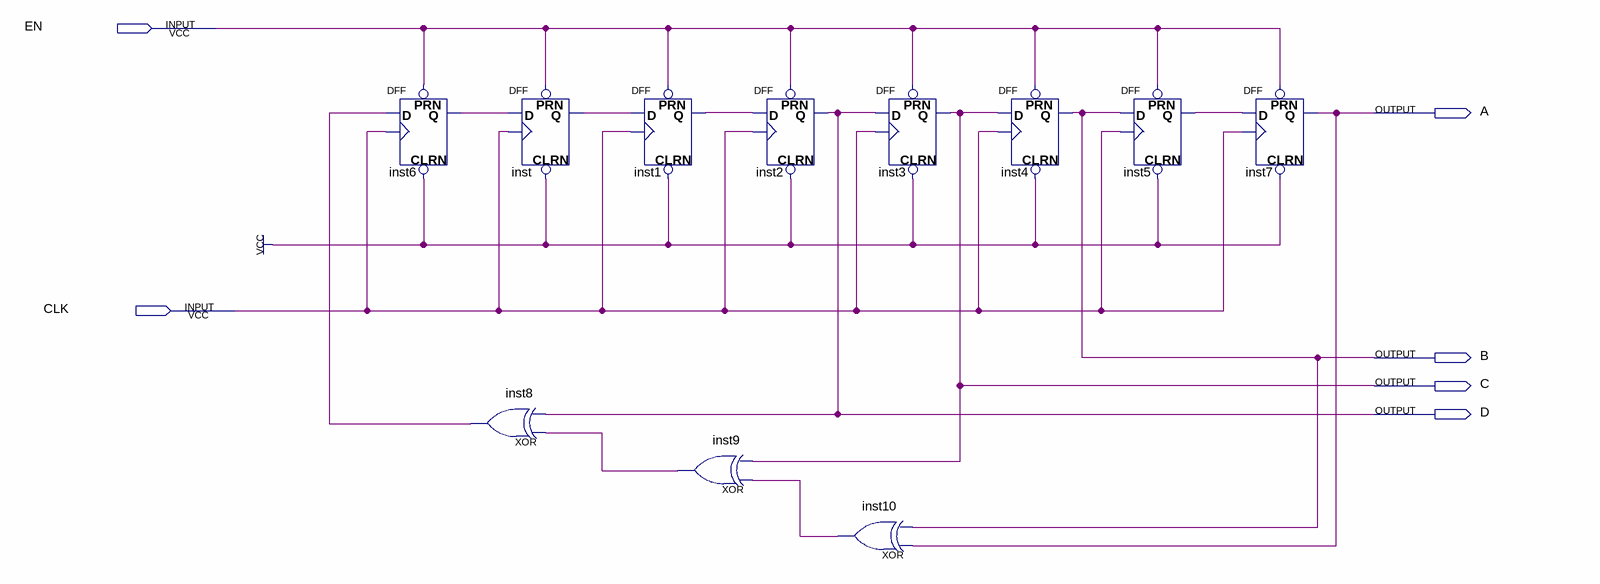
[diagram p0: schematic sheet]
// Quartus schematic LFSR.bdf as structural Verilog: 11 symbols, 6 pins
module LFSR (
  input  EN,
  input  CLK,
  output A,
  output B,
  output C,
  output D
);

  wire inst1_q, inst5_q, inst6_q, inst8_out, inst9_out, inst10_out, inst_q;

  DFF inst6 (.CLRN(1'b1), .CLK(CLK), .D(inst8_out), .PRN(EN), .Q(inst6_q));
  DFF inst (.CLRN(1'b1), .CLK(CLK), .D(inst6_q), .PRN(EN), .Q(inst_q));
  xor inst8 (inst8_out, inst9_out, D);
  DFF inst1 (.CLRN(1'b1), .CLK(CLK), .D(inst_q), .PRN(EN), .Q(inst1_q));
  xor inst9 (inst9_out, inst10_out, C);
  DFF inst2 (.CLRN(1'b1), .CLK(CLK), .D(inst1_q), .PRN(EN), .Q(D));
  DFF inst3 (.CLRN(1'b1), .CLK(CLK), .D(D), .PRN(EN), .Q(C));
  xor inst10 (inst10_out, A, B);
  DFF inst4 (.CLRN(1'b1), .CLK(CLK), .D(C), .PRN(EN), .Q(B));
  DFF inst5 (.CLRN(1'b1), .CLK(CLK), .D(B), .PRN(EN), .Q(inst5_q));
  DFF inst7 (.CLRN(1'b1), .CLK(CLK), .D(inst5_q), .PRN(EN), .Q(A));
endmodule
